# EAGLE design nixie-in2-x3.1-mainboard (EAGLE 5.04)
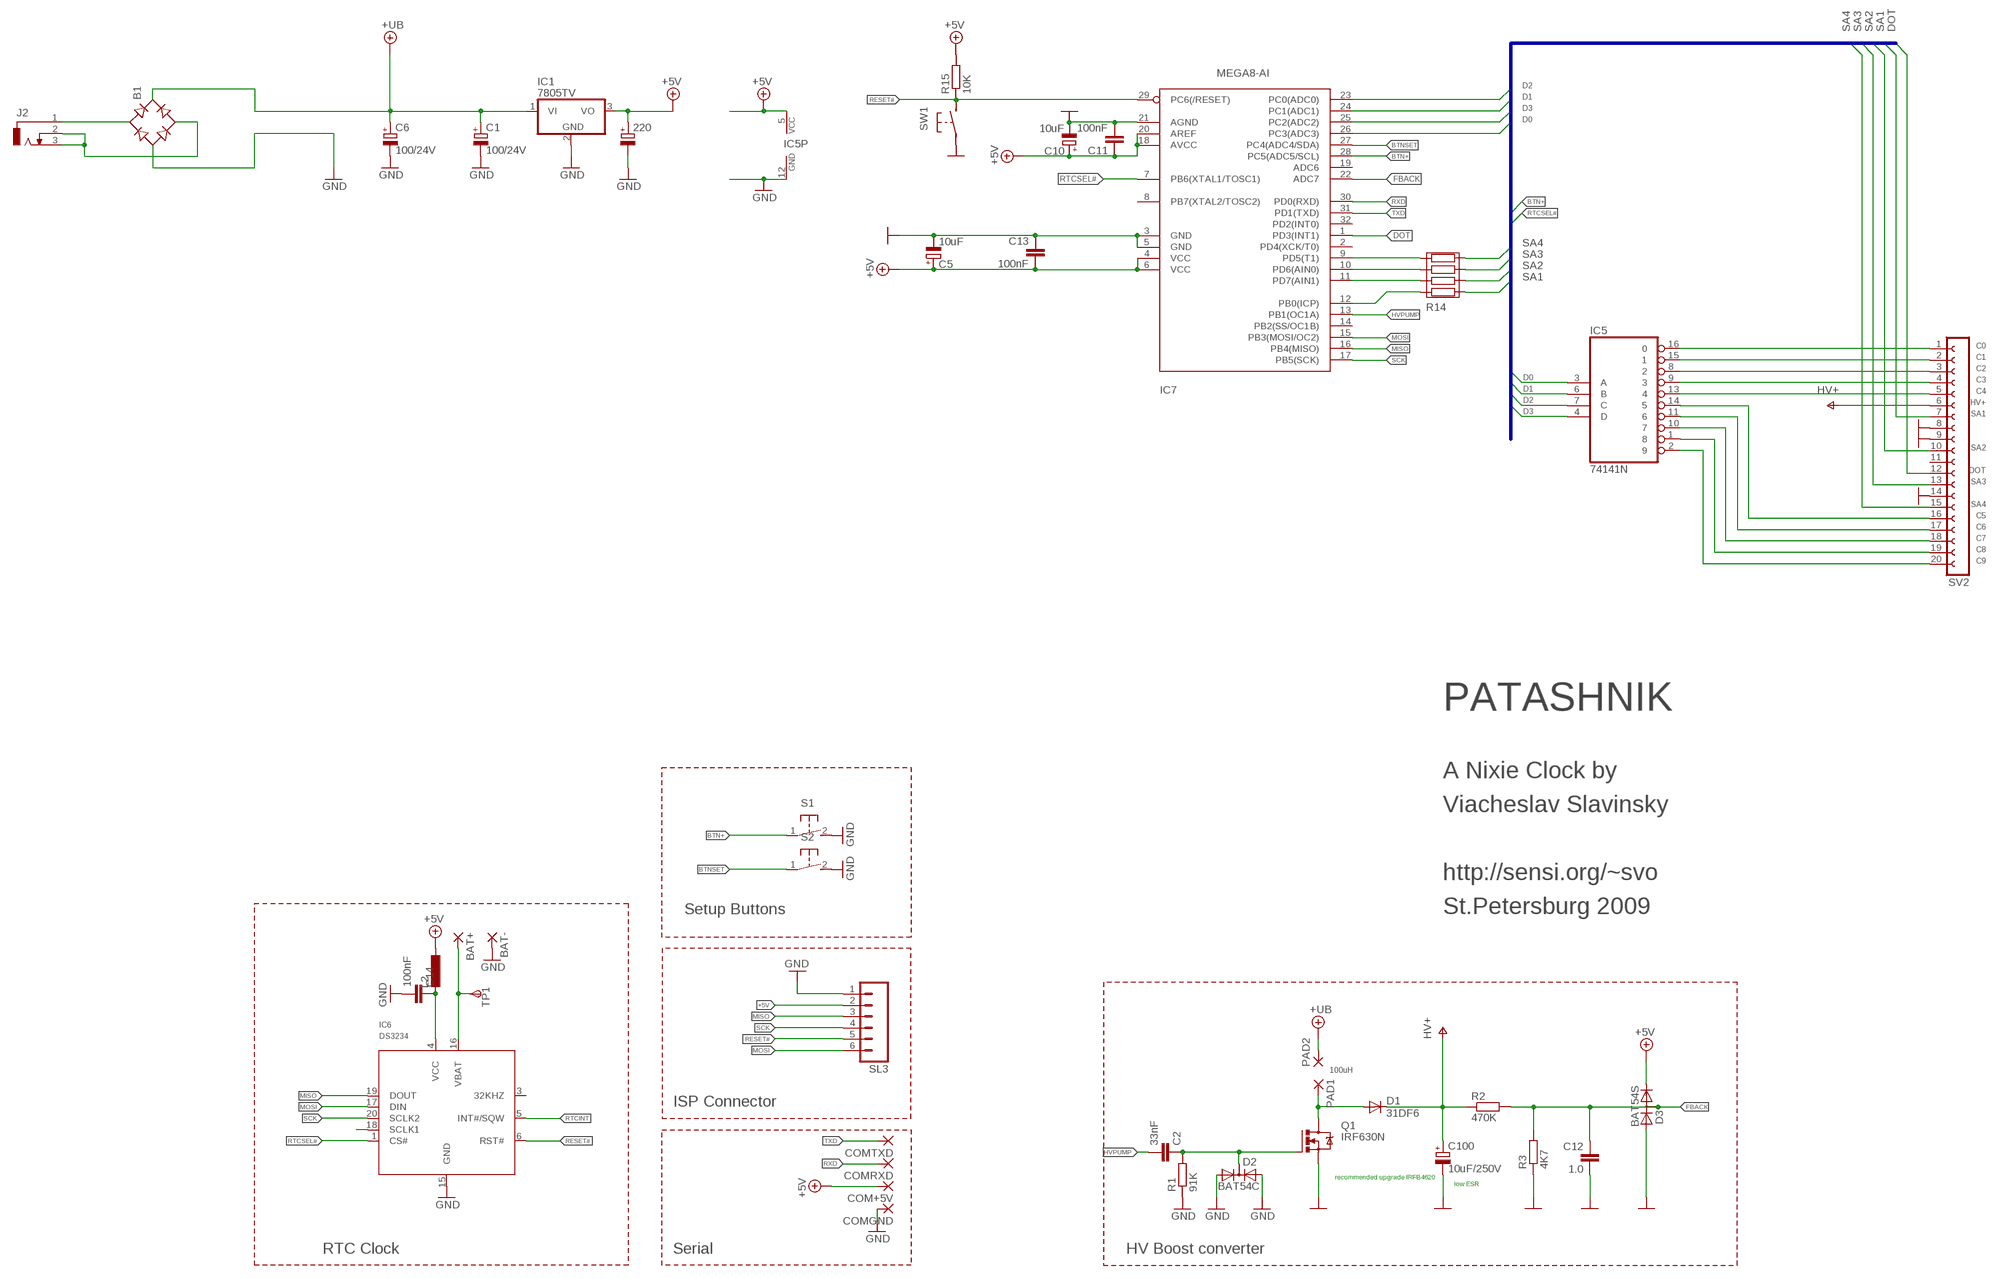
[diagram p0: schematic, sheet 1]

## Parts
220  CPOL-EUD/7343-31R  [D/7343-31R]
B1  B-DIL  [B-DIL]
BAT+  1,6/0,8  [1,6/0,8]
BAT-  1,6/0,8  [1,6/0,8]
C1  100/24V  CPOL-EUE3.5-8  [E3,5-8]
C2  33nF  C-EUC0805S  [C0805S]
C5  10uF  CPOL-EUSMCB  [SMC_B]
C6  100/24V  CPOL-EUE3.5-8  [E3,5-8]
C10  10uF  CPOL-EUSMCB  [SMC_B]
C11  100nF  C-EUC0603K  [C0603K]
C12  1.0  C-EUC0805S  [C0805S]
C13  100nF  C-EUC0603K  [C0603K]
C14  100nF  C-EUC0603K  [C0603K]
C100  10uF/250V  CPOL-EUE5-13  [E5-13]
COM+5V  1,6/0,8  [1,6/0,8]
COMGND  1,6/0,8  [1,6/0,8]
COMRXD  1,6/0,8  [1,6/0,8]
COMTXD  1,6/0,8  [1,6/0,8]
D1  31DF6  RGP30  [DO201-15]
D2  BAT54C  DIODE-2AC|CASOT23  [SOT23]
D3  BAT54S  DIODE_2CACA-SOT23  [SOT23@1]
IC1  7805TV  [TO220V]
IC5  74141N  [DIL16]
IC6  DS3234  [SO-20DW]
IC7  MEGA8-AI  [TQFP32-08]
J2  DCJ-SMALL  [DCJ-SMALL]
L2  L-EUL4532C  [L4532M]
PAD1  1,6/0,8  [1,6/0,8]
PAD2  1,6/0,8  [1,6/0,8]
Q1  IRF630N  IRF740  [TO220BV]
R1  91K  R-EU_R0805S  [R0805-SVO]
R2  470K  R-EU_R0805S  [R0805-SVO]
R3  4K7  R-EU_R0805S  [R0805-SVO]
R14  RES4  [RESSMD-YC16]
R15  10K  R-EU_R0805S  [R0805-SVO]
S1  31-XX  [B3F-31XX]
S2  31-XX  [B3F-31XX]
SL3  M06  [06P]
SV2  FE20-1  [FE20]
SW1  BUTTON-IT_1181  [SW_IT1181]
TP1  TPSTP20SQ  [TP20SQ]

## Nets
+5V: 220.+ C5.+ C10.+ C11.1 C13.2 COM+5V.1(P) D3.2(C) IC1.3(VO) IC5.5(VCC) IC7.4(VCC) IC7.6(VCC) IC7.18(AVCC) IC7.20(AREF) L2.1 R15.2 SL3.2
+UB: B1.+ C1.+ C6.+ IC1.1(VI) PAD2.1(P)
BTN+: IC7.28(PC5(ADC5/SCL)) S1.1(P)
BTNSET: IC7.27(PC4(ADC4/SDA)) S2.1(P)
C0: IC5.16 SV2.1
C1: IC5.15 SV2.2
C2: IC5.8 SV2.3
C3: IC5.9 SV2.4
C4: IC5.13 SV2.5
C5: IC5.14 SV2.16
C6: IC5.11 SV2.17
C7: IC5.10 SV2.18
C8: IC5.1 SV2.19
C9: IC5.2 SV2.20
D0: IC5.3(A) IC7.26(PC3(ADC3))
D1: IC5.6(B) IC7.24(PC1(ADC1))
D2: IC5.7(C) IC7.23(PC0(ADC0))
D3: IC5.4(D) IC7.25(PC2(ADC2))
DOT: IC7.1(PD3(INT1)) SV2.12
FBACK: C12.1 D3.3(AC) IC7.22(ADC7) R2.2 R3.2
GND: 220.- B1.- BAT-.1(P) C1.- C5.- C6.- C10.- C11.2 C12.2 C13.1 C14.2 C100.- COMGND.1(P) D2.1(A1) D2.2(A2) D3.1(A) IC1.2(GND) IC5.12(GND) IC6.15(GND) IC7.3(GND) IC7.5(GND) IC7.21(AGND) Q1.S R1.1 R3.1 S1.2(S) S2.2(S) SL3.1 SV2.8 SV2.9 SV2.14 SW1.P$1(P1)
HV+: C100.+ D1.C R2.1 SV2.6
HVPUMP: C2.2 IC7.13(PB1(OC1A))
MISO: IC6.19(DOUT) IC7.16(PB4(MISO)) SL3.3
MOSI: IC6.17(DIN) IC7.15(PB3(MOSI/OC2)) SL3.6
N$2: IC6.18(SCLK1)
N$3: C2.1 D2.3(C) Q1.G R1.2
N$7: D1.A PAD1.1(P) Q1.D
N$9: BAT+.1(P) IC6.16(VBAT) TP1.TP(PP)
N$31: IC7.11(PD7(AIN1)) R14.R2$1(2.1)
N$32: IC7.10(PD6(AIN0)) R14.R3$1(3.1)
N$34: IC7.9(PD5(T1)) R14.R4$1(4.1)
N$35: IC7.12(PB0(ICP)) R14.R1$1(1.1)
N$53: C14.1 IC6.4(VCC) L2.2
N$64: B1.AC2 J2.2 J2.3
N$65: B1.AC1 J2.1
RESET#: IC6.6(RST#) IC7.29(PC6(/RESET)) R15.1 SL3.5 SW1.P$2(P2)
RTCINT: IC6.5(INT#/SQW)
RTCSEL#: IC6.1(CS#) IC7.7(PB6(XTAL1/TOSC1))
RXD: COMRXD.1(P) IC7.30(PD0(RXD))
SA1: R14.R1$2(1.2) SV2.7
SA2: R14.R2$2(2.2) SV2.10
SA3: R14.R3$2(3.2) SV2.13
SA4: R14.R4$2(4.2) SV2.15
SCK: IC6.20(SCLK2) IC7.17(PB5(SCK)) SL3.4
TXD: COMTXD.1(P) IC7.31(PD1(TXD))
Unconnected: IC6.3(32KHZ) IC7.2(PD4(XCK/T0)) IC7.8(PB7(XTAL2/TOSC2)) IC7.14(PB2(SS/OC1B)) IC7.19(ADC6) IC7.32(PD2(INT0)) SV2.11

## Buses
D[0..3],SA[1..4],DOT

## Notes on the sheet
- PATASHNIK
- A Nixie Clock by
- Viacheslav Slavinsky
- http://sensi.org/~svo
- Setup Buttons | St.Petersburg 2009
- 100uH
- ISP Connector
- recommended upgrade IRFB4620
- low ESR
- RTC Clock | Serial | HV Boost converter

## Library data of the parts
220 C1 C5 C6 C10 C100 = rcl:CPOL-EU: POLARIZED CAPACITOR, European symbol
B1 = rectifier:B-DIL: RECTIFIER
BAT+ BAT- COM+5V COMGND COMRXD COMTXD PAD1 PAD2 = wirepad:1,6/0,8: THROUGH-HOLE PAD
C2 C11-C14 = rcl:C-EU: CAPACITOR, European symbol
D1 = diode:RGP30: DIODE fast-recovery rectifier
D2 = diode:DIODE-2AC|CA: Dual DIODE Anode-Cathode|Cathode-Anode
D3 = diode:DIODE_2CACA-: 2 Diodes - Cathode-Anode|Cathode-Anode
IC1 = linear:78*: Positive VOLTAGE REGULATOR Source: http://cache.national.com/ds/LM/LM78L05.pdf http://www.fairchildsemi.com/ds/LM/LM7805.pdf
IC5 = 74xx-eu:74*141: BCD to decimal DECODER/DRIVER
IC6 = 0-ds3234:DS3234*: Extremely Accurate SPI Bus RTC with Integrated Crystal and SRAM The DS3234 is a low-cost, extremely accurate SPI? bus real-time clock (RTC) with an integrated temperature-com- pensated crystal oscillator (TCXO) and crystal. The DS3234 incorporates a precision, temperature-compen- sated voltage reference and comparator circuit to monitor VCC. When VCCdrops below the power-fail voltage (VPF), the device asserts the RSToutput and also disables read and write access to the part when VCCdrops below both VPFand VBAT. The RSTpin is monitored as a pushbutton input for generating a µP reset. The device switches to the backup supply input and maintains accurate timekeeping when main power to the device is interrupted. The integra- tion of the crystal resonator enhances the long-term accu- racy of the device as well as reduces the piece-part count in a manufacturing line. The DS3234 is available in com- mercial and industrial temperature ranges, and is offered in an industry-standard 300-mil, 20-pin SO package. The DS3234 also integrates 256 bytes of battery-backed SRAM. In the event of main power loss, the contents of the memory are maintained by the power source con- nected to the VBATpin. The RTC maintains seconds, minutes, hours, day, date, month, and year information. The date at the end of the month is automatically adjust- ed for months with fewer than 31 days, including correc- tions for leap year. The clock operates in either the 24-hour or 12-hour format with AM/PM indicator. Two programmable time-of-day alarms and a programmable square-wave output are provided. Address and data are transferred serially by an SPI bidirectional bus. Accuracy ±2ppm from 0°C to +40°C Accuracy ±3.5ppm from -40°C to +85°C Battery Backup Input for Continuous Timekeeping Operating Temperature Ranges Commercial: 0°C to +70°C Industrial: -40°C to +85°C Low-Power Consumption Real-Time Clock Counts Seconds, Minutes, Hours, Day, Date, Month, and Year with Leap Year Compensation Valid Up to 2099 Two Time-of-Day Alarms Programmable Square-Wave Output 4MHz SPI Bus Supports Modes 1 and 3 Digital Temp Sensor Output: ±3°C Accuracy Register for Aging Trim RSTInput/Output 300-Mil, 20-Pin SO Package Underwriters Laboratories (UL®) Recognized
IC7 = atmel:MEGA8: MICROCONTROLLER 8 Kbytes FLASH, 1 kbytes SRAM, 512 bytes EEPROM, USART, 6-channel 10 bit ADC, 2-channel 8 bit ADC Pin compatible with Atmega48, ATMega88, ATMega168 Source: avr.lbr
J2 = 0-svo:DCJ-SMALL: Smaller DC power jack
L2 = rcl:L-EU: INDUCTOR, European symbol
Q1 = transistor-power:IRF740: N-CHANNEL MOS FET
R1-R3 R15 = rcl:R-EU_: RESISTOR, European symbol
R14 = 0-svo:RES4
S1 S2 = switch-omron:31-XX: OMRON SWITCH
SL3 = con-amp-quick:M06: AMP QUICK CONNECTOR
SV2 = con-lsta:FE20-1: FEMALE HEADER
SW1 = 0-svo:BUTTON-IT_1181
TP1 = 0-svo:TPS: TEST PIN

## Board
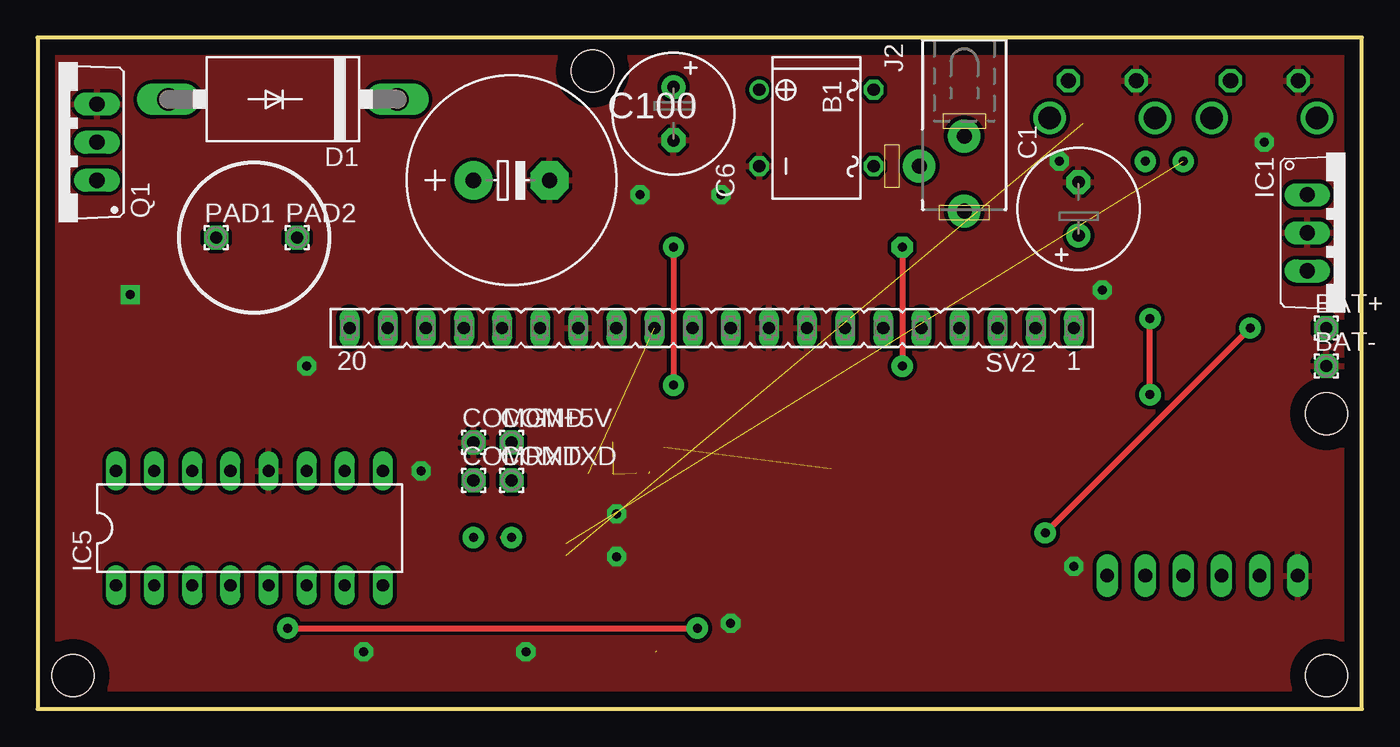
[diagram p1: board, top side]
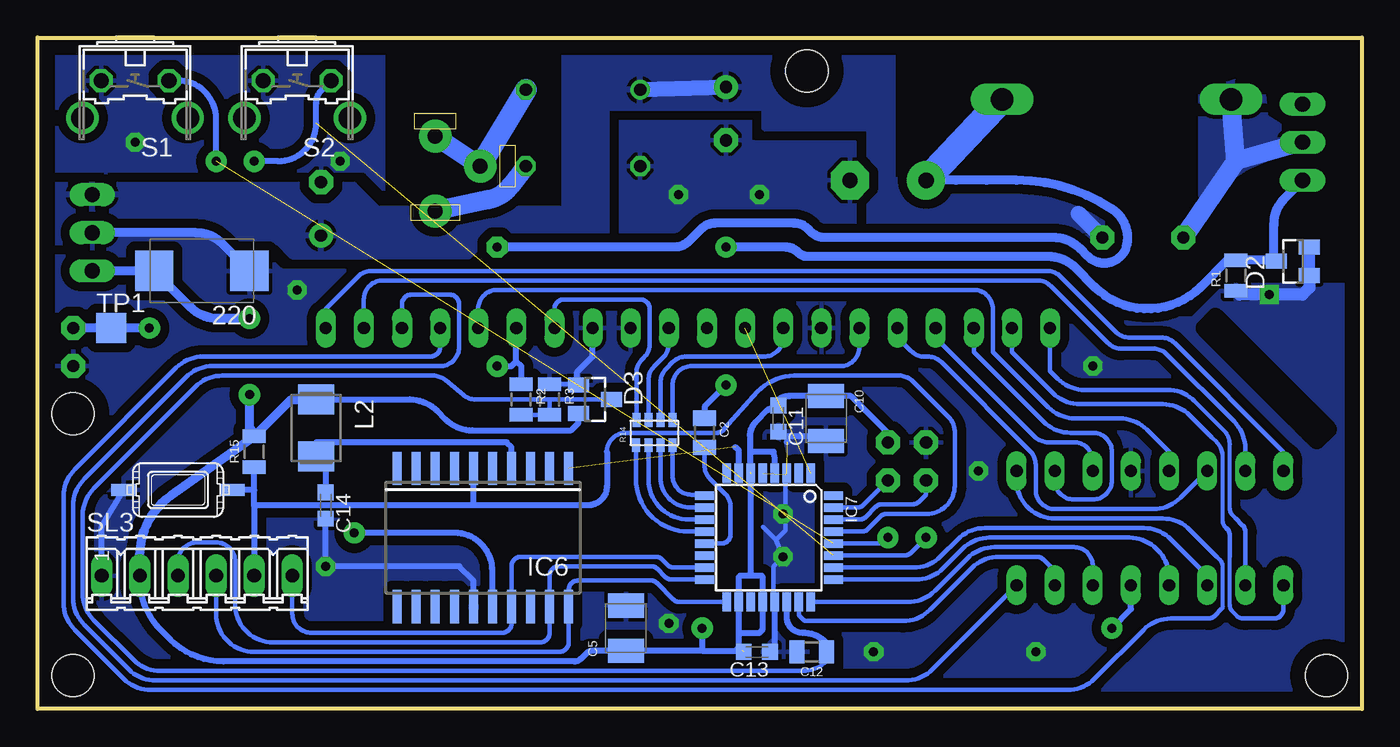
[diagram p2: board, bottom side, seen from below]

Size 88.25 x 44.76 mm. Coordinates in mm from the lower left corner, seen from the top.
Outline: 0,0 88.25,0 88.25,44.76 0,44.76 0,0
Copper layers (1*16): Top 0.035mm / dielectric 1.5mm / Bottom 0.035mm
Design rules "default *": minimum track width 10mil, minimum drill 24mil, track to track 10mil, track to pad 10mil, pad to pad 8mil, via to via 8mil, smd to smd 8mil, copper to edge 40mil, drill to drill 8mil, minimum pad ring 10mil, minimum via ring 8mil, stop-mask expansion 4mil, vias tented up to drill 0mil, thermal gap 10mil
Holes 2.8 mm at 2.38,2.22 36.98,42.54 85.88,19.68 85.88,2.22
bRestrict: area 2.3,17.9 to 10.5,26.1

### Footprints (pad centres in the part's own frame; a part is rotated, then mirrored left to right if it is on the bottom)
D/7343-31R = smd 2.55 x 2.7: + 3.175,0; - -3.175,0
B-DIL = drill 0.813 round: + -2.54,-3.81 | drill 0.813 octagon: - 2.54,-3.81; AC1 2.54,3.81; AC2 -2.54,3.81
1,6/0,8 = drill 0.813 pad 1.6 octagon: 1 0,0
E3,5-8 = drill 0.813 pad 1.6 round: + -1.778,0 | drill 0.813 pad 1.6 octagon: - 1.778,0
C0805S = smd 1.016 x 1.524: 1 -0.977,0; 2 0.977,0
SMC_B = smd 1.6 x 2.4: + -1.5,0; - 1.5,0
C0603K = smd 1.05 x 1.08: 1 -0.875,0; 2 0.875,0
E5-13 = drill 1.016 pad 2.54 round: + -2.54,0 | drill 1.016 pad 2.54 octagon: - 2.54,0
DO201-15 = drill 1.499 long: A 7.62,0; C -7.62,0
SOT23 = smd 1 x 1.4: 1 -0.95,-1.1; 2 0.95,-1.1; 3 0,1.1
SOT23@1 = smd 1 x 1.4: 1 -0.95,-1.1; 2 0.95,-1.1; 3 0,1.1
TO220V = drill 1.016 long: 1 -2.54,-2.54; 2 0,-2.54; 3 2.54,-2.54
DIL16 = drill 0.813 long: 1 -8.89,-3.81; 2 -6.35,-3.81; 3 -3.81,-3.81; 4 -1.27,-3.81; 5 1.27,-3.81; 6 3.81,-3.81; 7 6.35,-3.81; 8 8.89,-3.81; 9 8.89,3.81; 10 6.35,3.81; 11 3.81,3.81; 12 1.27,3.81; 13 -1.27,3.81; 14 -3.81,3.81; 15 -6.35,3.81; 16 -8.89,3.81
SO-20DW = smd 0.6 x 2.2: 1 -5.715,-4.6; 2 -4.445,-4.6; 3 -3.175,-4.6; 4 -1.905,-4.6; 5 -0.635,-4.6; 6 0.635,-4.6; 7 1.905,-4.6; 8 3.175,-4.6; 9 4.445,-4.6; 10 5.715,-4.6; 11 5.715,4.6; 12 4.445,4.6; 13 3.175,4.6; 14 1.905,4.6; 15 0.635,4.6; 16 -0.635,4.6; 17 -1.905,4.6; 18 -3.175,4.6; 19 -4.445,4.6; 20 -5.715,4.6
TQFP32-08 = smd 1.27 x 0.559: 1 -4.293,2.8; 2 -4.293,2; 3 -4.293,1.2; 4 -4.293,0.4; 5 -4.293,-0.4; 6 -4.293,-1.2; 7 -4.293,-2; 8 -4.293,-2.8; 17 4.293,-2.8; 18 4.293,-2; 19 4.293,-1.2; 20 4.293,-0.4; 21 4.293,0.4; 22 4.293,1.2; 23 4.293,2; 24 4.293,2.8 | smd 0.559 x 1.27: 9 -2.8,-4.293; 10 -2,-4.293; 11 -1.2,-4.293; 12 -0.4,-4.293; 13 0.4,-4.293; 14 1.2,-4.293; 15 2,-4.293; 16 2.8,-4.293; 25 2.8,4.293; 26 2,4.293; 27 1.2,4.293; 28 0.4,4.293; 29 -0.4,4.293; 30 -1.2,4.293; 31 -2,4.293; 32 -2.8,4.293
DCJ-SMALL = drill 1 pad 2.184 round: 1 0,3; 2 3,0; 3 0,-2
L4532M = smd 2 x 2.4: 1 -1.9,0; 2 1.9,0
TO220BV = drill 1.016 long: D 0,-2.54; G -2.54,-2.54; S 2.54,-2.54
R0805-SVO = smd 0.9 x 1.524: 1 -1.027,0; 2 1.027,0
RESSMD-YC16 = smd 0.508 x 0.914: R1$1 -1.23,-0.821; R1$2 -1.2,0.851; R2$1 -0.4,-0.821; R2$2 -0.4,0.851; R3$1 0.4,-0.821; R3$2 0.4,0.851; R4$1 1.2,-0.821; R4$2 1.2,0.851
B3F-31XX = drill 1.016 octagon: 1 -2.261,-1.245; 2 2.261,-1.245 | drill 1.499 pad 2.159 round: 3 -3.505,1.245; 4 3.505,1.245
06P = drill 0.914 long: 1 -6.35,0; 2 -3.81,0; 3 -1.27,0; 4 1.27,0; 5 3.81,0; 6 6.35,0
FE20 = drill 0.813 long: 1 -24.13,0; 2 -21.59,0; 3 -19.05,0; 4 -16.51,0; 5 -13.97,0; 6 -11.43,0; 7 -8.89,0; 8 -6.35,0; 9 -3.81,0; 10 -1.27,0; 11 1.27,0; 12 3.81,0; 13 6.35,0; 14 8.89,0; 15 11.43,0; 16 13.97,0; 17 16.51,0; 18 19.05,0; 19 21.59,0; 20 24.13,0
SW_IT1181 = smd 1.676 x 0.813: P$1 -3.61,0; P$2 3.61,0
TP20SQ = smd 2 x 2: TP 0,0

### Placement (x,y rotation side)
220  77.31,29.21 180 bottom
B1  51.91,38.73 270 top
BAT+  85.88,25.39 0 top
BAT-  85.88,22.86 0 top
C1  69.37,33.33 90 top
C2  43.81,18.41 270 bottom
C5  49.05,5.39 90 bottom
C6  42.38,39.68 270 top
C10  35.71,19.36 270 bottom
C11  38.89,19.36 270 bottom
C12  36.66,3.81 180 bottom
C13  40.32,3.81 180 bottom
C14  69.05,13.57 270 bottom
C100  31.59,35.24 0 top
COM+5V  31.59,17.77 0 top
COMGND  29.05,17.77 0 top
COMRXD  29.05,15.24 0 top
COMTXD  31.59,15.24 0 top
D1  16.34,40.64 180 top
D2  4.6,29.84 90 bottom
D3  51.11,20.63 270 bottom
IC1  87.15,31.75 270 top
IC5  14.12,12.06 0 top
IC6  58.57,11.43 180 bottom
IC7  39.52,11.43 270 bottom
J2  61.75,36.19 180 top
L2  69.69,18.73 270 bottom
PAD1  11.9,31.43 0 top
PAD2  17.3,31.43 0 top
Q1  1.42,37.78 90 top
R1  8.41,28.89 90 bottom
R2  56.03,20.63 270 bottom
R3  54.13,20.63 270 bottom
R14  47.14,18.41 0 bottom
R15  73.81,17.14 90 bottom
S1  81.75,40.64 180 bottom
S2  70.95,40.64 180 bottom
SL3  77.62,8.88 0 bottom
SV2  44.92,25.39 180 top
SW1  78.89,14.6 0 bottom
TP1  83.34,25.39 0 bottom

### Tracks (layer width: path | path; a pad name or v marks a point on that pad's centre or on a via)
+5V  (via drill 0.6 pad 1.42)  (3 unrouted)
  Top 0.406: v16.66,5.39 v43.97,5.39 | v74.13,20.95 v74.13,26.03
  Bottom 0.305: 39.92,8.81 40,8.88 | IC7.20 | 40.79,8.88 40.71,8.96 | L2.1 | 40.72,17.05 IC7.6
  Bottom 0.406: 40,8.88 40.79,8.88 41.43,8.88 | 39.92,8.81 IC7.20 39.92,5.31 40.16,5.08 41.52,5.08 | 40.71,8.96 40.71,15.71 | 40.79,15.79 40.79,18.2 arc45 40.42,19.1 39.6,19.92 C11.1 39.2,20.31 39.03,20.49 arc45 38.13,20.86 C10.+ 34.04,20.86 31.59,18.41 COM+5V.1 | 41.52,8.79 41.52,7.23 41.51,7.22 41.51,7.14 | 41.51,7.14 41.51,6.98 | 41.59,7.22 41.51,7.14 | 41.59,7.22 41.59,7.62 | 41.59,7.22 41.59,6.9 41.52,6.96 IC7.18 41.52,5.08 | D3.2 52.21,19.06 52.7,18.57 59.27,18.57 arc45 61.06,19.31 61.64,19.89 arc-45 63.43,20.63 L2.1 | SL3.2 81.43,8.73 arc-45 79.97,5.2 79.4,4.63 arc-45 75.87,3.17 52.49,3.17 arc-45 52.04,3.36 51.69,3.71 arc45 51.24,3.89 C5.+ 43.97,3.89 | 41.74,3.89 41.28,3.89 | 43.97,3.89 41.74,3.89 | 41.52,5.08 41.52,4.12 41.74,3.89 | IC5.5 15.39,6.66 v16.66,5.39 | v43.97,5.39 43.97,3.89 | R15.2 73.81,18.41 | IC7.4 39.12,16.74 39.2,17.14 40.63,17.14 40.72,17.05
  Bottom 0.61: SL3.2 81.43,10.18 arc55 79.32,14.26 R15.2 71.35,20.63 L2.1 | IC1.3 220.+ 78.04,26.76 arc-45 76.27,26.03 v74.13,26.03 | v74.13,20.95 74.13,18.73 73.81,18.41
+UB
  Bottom 1.016: C6.+ B1.+ | PAD2.1 18.89,33.02
  pour Bottom (isolate 0.61): 15.71,31.11 15.71,32.06 18.89,35.24 31.27,35.24 31.27,44.76 53.17,44.76 53.17,33.33 65.56,33.33 67.14,34.92 89.37,34.92 89.37,31.11 72.22,31.11 71.27,30.16 59.53,30.16 58.89,30.79 50.32,30.79 50.32,40.08 39.84,40.08 39.84,38.73 32.85,38.73 32.85,31.11
BTN+  (via drill 0.6 pad 1.42)  (1 unrouted)
  Top 0.305: v31.59,11.43 30.95,11.43
  Bottom 0.305: IC7.28 32.25,11.03 arc-45 31.8,11.21 v31.59,11.43
  Bottom 0.406: v76.35,36.51 76.35,36.83 76.35,39.34 arc-90 78.89,41.88 S1.1
BTNSET  (via drill 0.6 pad 1.42)  (1 unrouted)
  Top 0.305: v29.05,11.43 28.73,11.43
  Bottom 0.305: IC7.27 30.51,10.22 arc-45 30.06,10.41 v29.05,11.43
  Bottom 0.406: S2.1 69.31,41.26 arc-45 69.69,40.36 69.69,39.05 arc90 72.22,36.51 v73.81,36.51
C0
  Bottom 0.305: SV2.1 69.05,26.66 66.88,28.83 arc45 65.98,29.21 21,29.21 arc45 20.1,28.83 16.4,25.13 arc-45 15.5,24.76 13.38,24.76 arc45 12.48,24.39 5.23,17.14 IC5.16
C1
  Bottom 0.305: IC5.15 7.77,17.36 arc-45 8.52,19.15 13.01,23.64 arc-45 13.9,24.02 16.03,24.02 arc45 16.93,24.39 20.74,28.2 arc-45 21.63,28.57 65.24,28.57 arc-90 66.51,27.3 SV2.2
C2
  Bottom 0.305: SV2.3 63.97,26.98 arc90 63.33,27.62 60.8,27.62 arc90 60.16,26.98 60.16,24.12 arc90 61.43,22.86 76.57,22.86 arc-45 78.37,22.11 85.13,15.34 arc-45 85.88,13.55 85.88,7.4 arc-45 85.13,5.6 82.18,2.64 arc-45 80.38,1.9 30.41,1.9 arc-45 28.62,2.64 IC5.8
C3
  Bottom 0.254: 9.36,6.66 arc-45 9.28,6.85 9.28,9.5 arc-45 9.47,9.94 9.68,10.16
  Bottom 0.305: 9.36,6.66 9.81,6.21 arc45 10.26,6.03 12.75,6.03 arc-45 14.55,5.28 17.82,2.01 arc45 19.62,1.27 80.7,1.27 arc45 82.49,2.01 85.77,5.28 arc45 86.51,7.08 86.51,14.18 arc45 85.77,15.98 79,22.75 arc45 77.21,23.49 62.06,23.49 arc-90 61.43,24.12 SV2.4 | 9.68,10.16 11.47,11.95 arc-45 13.27,12.7 20.47,12.7 arc90 23.01,15.24 IC5.9
C4
  Bottom 0.305: SV2.5 58.89,26.66 arc90 57.62,27.93 25.87,27.93 arc90 24.6,26.66 24.6,23.81 20.9,20.11 arc-45 19.1,19.36 16.13,19.36 arc45 14.33,18.62 12.85,17.14 IC5.13
C5
  Bottom 0.305: SV2.16 30.95,24.76 30.05,23.86 arc-45 29.15,23.49 28.94,23.49 arc45 28.04,23.12 22.11,17.19 arc45 21.74,16.3 21.74,14.6 arc-90 20.47,13.33 13.9,13.33 arc-45 12.11,14.07 IC5.14
C6
  Bottom 0.305: IC5.11 17.93,16.5 arc-90 19.2,17.77 20.9,17.77 arc45 21.8,18.15 28.41,24.76 SV2.17
C7
  Bottom 0.305: SV2.18 25.87,23.81 21.22,19.15 arc-45 19.42,18.41 17.93,18.41 arc90 16.66,17.14 16.66,15.24 arc90 17.93,13.97 19.2,13.97 arc90 20.47,15.24 IC5.10
C8
  Bottom 0.254: 7.77,6.03 7.91,6.03 arc45 8.36,6.21 8.62,6.48 arc45 8.8,6.93 8.8,10.16 | 9.04,12.06 9.09,12.11 arc45 9.28,12.56 9.28,16.85 arc-45 9.65,17.75 9.99,18.09
  Bottom 0.305: 7.77,6.03 5.87,6.03 arc-90 5.23,6.66 IC5.1 | SV2.19 23.33,23.81 20.58,21.06 arc-45 18.79,20.31 13.27,20.31 arc45 11.47,19.57 9.99,18.09 | 8.8,10.16 8.8,11.56 arc-45 8.99,12.01 9.04,12.06
C9
  Bottom 0.254: 8.41,12.7 8.62,12.91 arc45 8.8,13.36 8.8,17.65 arc-45 9.18,18.54 11.16,20.52
  Bottom 0.305: SV2.20 20.79,22.54 20.26,22.01 arc-45 18.47,21.27 12.95,21.27 arc45 11.16,20.52 | IC5.2 7.77,11.8 arc-45 7.96,12.25 8.41,12.7
D0
  Bottom 0.305: IC5.3 10.31,8.88 12.74,11.32 arc-45 14.54,12.06 25.14,12.06 arc-45 26.93,11.32 28.08,10.17 arc45 29.87,9.43 IC7.26
D1
  Bottom 0.305: IC7.24 30.26,7.13 arc-45 28.47,7.88 26.3,10.05 arc45 24.5,10.79 19.2,10.79 arc90 17.93,9.52 IC5.6
D2
  Bottom 0.305: IC5.7 20.47,9.2 21.24,9.97 arc-45 21.69,10.16 24.18,10.16 arc-45 25.98,9.41 28.78,6.61 arc45 30.57,5.87 37.14,5.87 37.52,6.25 IC7.23
D3
  Bottom 0.305: IC5.4 12.85,8.79 arc-45 13.6,10.58 13.7,10.68 arc-45 15.49,11.43 24.82,11.43 arc-45 26.61,10.68 27.93,9.37 arc45 29.72,8.62 IC7.25
DOT  (1 unrouted)
FBACK
  Bottom 0.305: R2.2 R3.2 54.13,20.63 | 54.13,20.63 D3.3 | C12.1 35.71,4.1 35.71,3.17 arc45 37.25,2.53 80.06,2.53 arc45 81.86,3.28 84.5,5.92 arc45 85.24,7.71 85.24,12.91 arc45 84.5,14.71 77.73,21.48 arc45 75.94,22.22 61.89,22.22 arc40 61.08,21.93 59.88,20.93 arc-40 59.07,20.63 54.45,20.63 54.13,20.63
  Bottom 0.406: C12.1 35.69,4.42 arc-45 37.28,5.08 arc90 38.32,6.12 IC7.22
GND  (via drill 0.6 pad 1.27)  (3 unrouted)
  Bottom 0.305: 38.41,15.63 38.41,11.9 39.05,11.27 | 39.05,11.27 v38.57,10.16 39.2,9.52 39.2,7.21 IC7.21 | 39.05,11.27 39.92,12.14 | R3.1 52.29,21.66 D3.1
  Bottom 0.406: SL3.1 83.97,12.18 SW1.P$1 | 35.71,18.17 38.33,18.18 | 35.71,18.17 arc-44 35.71,18.17 | C10.- 35.71,18.17 | 38.33,18.18 38.9,18.18 C11.2 | 38.33,18.18 38.32,17.79 | 39.12,3.81 IC7.21 | 52.29,21.66 52.29,22.47 51.27,23.49 SV2.8 | IC6.15 59.21,8.57 60.16,9.52 v69.05,9.52 C14.2 | IC7.3 38.33,15.73
  Bottom 0.61: 220.- 75.94,31.01 arc-45 77.71,31.75 IC1.2
  Bottom 0.813: D2.2 D2.1 3.5,28.08 3.96,27.62 v6.19,27.62 8.16,27.62 R1.1
  other vias: 21.74,3.81 32.54,3.81 25.55,15.87 40.16,34.29 45.55,34.29 17.93,22.86 81.75,37.78 70.95,27.93 38.57,13.01 68.1,36.51 46.19,5.71
  pour Top: -1.12,45.4 89.05,45.4 89.05,-0.96 -1.12,-0.96
  pour Bottom (isolate 0.61, rank 2): 0.47,28.25 9.04,28.25 11.27,26.03 16.66,26.03 18.89,28.25 33.81,28.25 33.81,37.78 40.79,37.78 40.79,39.29 49.37,39.29 49.37,28.25 64.61,28.25 arc90 65.24,29.52 65.24,44.13 88.73,44.13 88.73,-0.64 -0.48,-0.64 -0.48,27.62
HV+  (via drill 0.6 pad 1.42)
  Top 0.406: v57.62,30.79 v57.62,22.86
  Bottom 0.406: 56.35,23.17 SV2.6 | R2.1 56.03,22.86 56.35,23.17 | v57.62,22.86 56.67,22.86 56.35,23.17
  Bottom 0.61: v57.62,30.79 45.76,30.79 arc-45 44.87,31.16 44.02,32.01 arc45 43.12,32.38 37.83,32.38 arc45 36.93,32.01 36.72,31.8 arc-45 35.82,31.43 20.57,31.43 arc45 18.78,30.68 18.25,30.16 arc-118 15.71,30.79 arc-34 15.71,32.06 arc-40 16.66,33.33 arc-33 23.01,35.24 arc0 C100.+ 28.73,34.92
  Bottom 1.778: C100.+ D1.C
HVPUMP
  Bottom 0.305: C2.2 43.81,16.24 arc-45 43.44,15.34 42.43,14.34 arc45 42.06,13.44 42.06,11.66 arc90 42.7,11.03 IC7.13
MISO
  Bottom 0.305: IC7.16 45.98,8.62 arc45 46.43,8.81 46.96,9.33 arc-45 47.41,9.52 53.49,9.52 arc-90 54.13,8.88 IC6.19 54.13,5.08 arc90 54.76,4.44 72.54,4.44 arc90 75.08,6.98 75.08,9.84 arc-90 76.35,11.11 77.62,11.11 arc-90 78.89,9.84 SL3.3
MOSI
  Bottom 0.305: IC7.15 45.83,9.43 arc45 46.28,9.61 46.64,9.97 arc-45 47.09,10.16 56.03,10.16 arc-90 56.67,9.52 IC6.17 56.67,5.71 arc90 57.3,5.08 70,5.08 arc90 71.27,6.35 SL3.6
N$3  (via drill 0.6 pad 1.42)
  Top 0.406: v42.38,30.79 v42.38,21.58
  Bottom 0.305: R1.2 8.49,30 | 6.41,29.91 D2.3 5.87,29.69
  Bottom 0.406: C2.1 43.81,20.16 v42.38,21.58
  Bottom 0.61: 6.41,29.91 R1.2 8.48,29.84 8.93,29.96 10.75,28.14 arc90 17.82,28.14 19.09,29.41 arc-45 20.89,30.16 36.93,30.16 arc45 37.56,30.42 arc-45 38.46,30.79 v42.38,30.79 | 5.87,29.69 5.87,32.28 arc45 5.12,34.08 Q1.G
N$7
  Bottom 1.27: Q1.D 8.41,36.51 | 8.41,36.51 PAD1.1 | 8.41,36.51 D1.A
  pour Bottom (isolate 0.406): 3.96,37.78 6.5,39.37 6.82,42.22 10.63,40.95 10.63,34.29 7.77,36.19
N$9  (via drill 0.6 pad 1.42)
  Top 0.406: v67.14,11.74 v80.8,25.39
  Bottom 0.406: IC6.16 57.94,9.2 arc-90 60.48,11.74 v67.14,11.74 | v80.8,25.39 81.11,25.39
  Bottom 0.61: 81.11,25.39 TP1.TP BAT+.1
N$31
  Bottom 0.305: IC7.11 44.84,12.63 arc90 47.54,15.33 R14.R2$1
N$32
  Bottom 0.305: IC7.10 44.74,13.42 arc90 46.74,15.42 R14.R3$1
N$34
  Bottom 0.305: R14.R4$1 45.94,15.55 arc-90 44.67,14.28 43.87,14.28 IC7.9
N$35
  Bottom 0.305: IC7.12 44.87,11.83 arc90 48.37,15.33 R14.R1$1
N$53
  Bottom 0.305: 69.05,16.82 L2.2
  Bottom 0.406: IC6.4 56.67,17.46 56.98,17.77 69.69,17.77 L2.2 | 69.05,16.82 C14.1
N$64
  Bottom 1.27: J2.2 J2.3
  Bottom 1.422: J2.2 B1.AC2
N$65
  Bottom 1.27: J2.1 58.21,33.94 arc-41 56.74,34.86 B1.AC1
RESET#
  Bottom 0.305: 50.32,17.14 arc90 49.05,18.41 43,18.41 arc-52 42.51,18.65 40.27,21.16 arc45 37.84,22.22 30.84,22.22 arc45 29.94,21.85 27.51,19.42 arc45 27.14,18.52 27.14,14.86 arc90 28.99,13.01 31.64,13.01 arc-45 32.09,12.83 32.9,12.01 arc45 33.35,11.83 IC7.29 | 73.73,13.57 73.81,13.49
  Bottom 0.406: SL3.5 73.81,13.49 73.81,14.6 | 50.32,17.14 50.32,14.84 arc90 51.59,13.57 59.21,13.57 | 59.21,13.57 IC6.6 | 59.21,13.57 73.73,13.57 | 73.81,14.6 R15.1 | 73.81,14.6 SW1.P$2
RTCSEL#  (1 unrouted)
  Bottom 0.406: IC7.7 41.52,17.23 41.74,17.46
RXD
  Bottom 0.305: IC7.30 33.51,12.63 arc-45 33.06,12.81 32.41,13.46 arc45 31.96,13.65 29.94,13.65 arc-45 29.49,13.83 29.05,14.28 COMRXD.1
SA1
  Bottom 0.305: R14.R1$2 48.34,22.4 arc45 47.97,23.3 47.83,23.43 arc-45 47.46,24.33 47.46,26.66 arc-90 48.09,27.3 53.17,27.3 arc-90 53.81,26.66 SV2.7
SA2
  Bottom 0.305: R14.R2$2 47.54,21.93 arc45 47.17,22.83 46.56,23.43 arc-45 46.19,24.33 SV2.10
SA3
  Bottom 0.305: R14.R3$2 46.74,21.78 arc45 46.37,22.67 45.93,23.12 arc45 45.03,23.49 39.84,23.49 arc-90 38.57,24.76 SV2.13
SA4
  Bottom 0.305: R14.R4$2 45.94,21.58 arc90 44.67,22.86 34.76,22.86 arc-90 33.49,24.12 SV2.15
SCK
  Bottom 0.305: IC7.17 45.44,7.13 arc45 45.89,7.32 46.96,8.38 arc-45 47.41,8.57 52.22,8.57 arc-90 52.86,7.93 IC6.20 52.86,4.44 arc90 53.49,3.81 73.81,3.81 arc90 76.35,6.35 SL3.4
TXD
  Bottom 0.305: IC7.31 33.66,13.42 arc-45 33.21,13.61 COMTXD.1

### Text on the board
Top: PATASHNIK
SMD16: 2010 | SATASHNIK